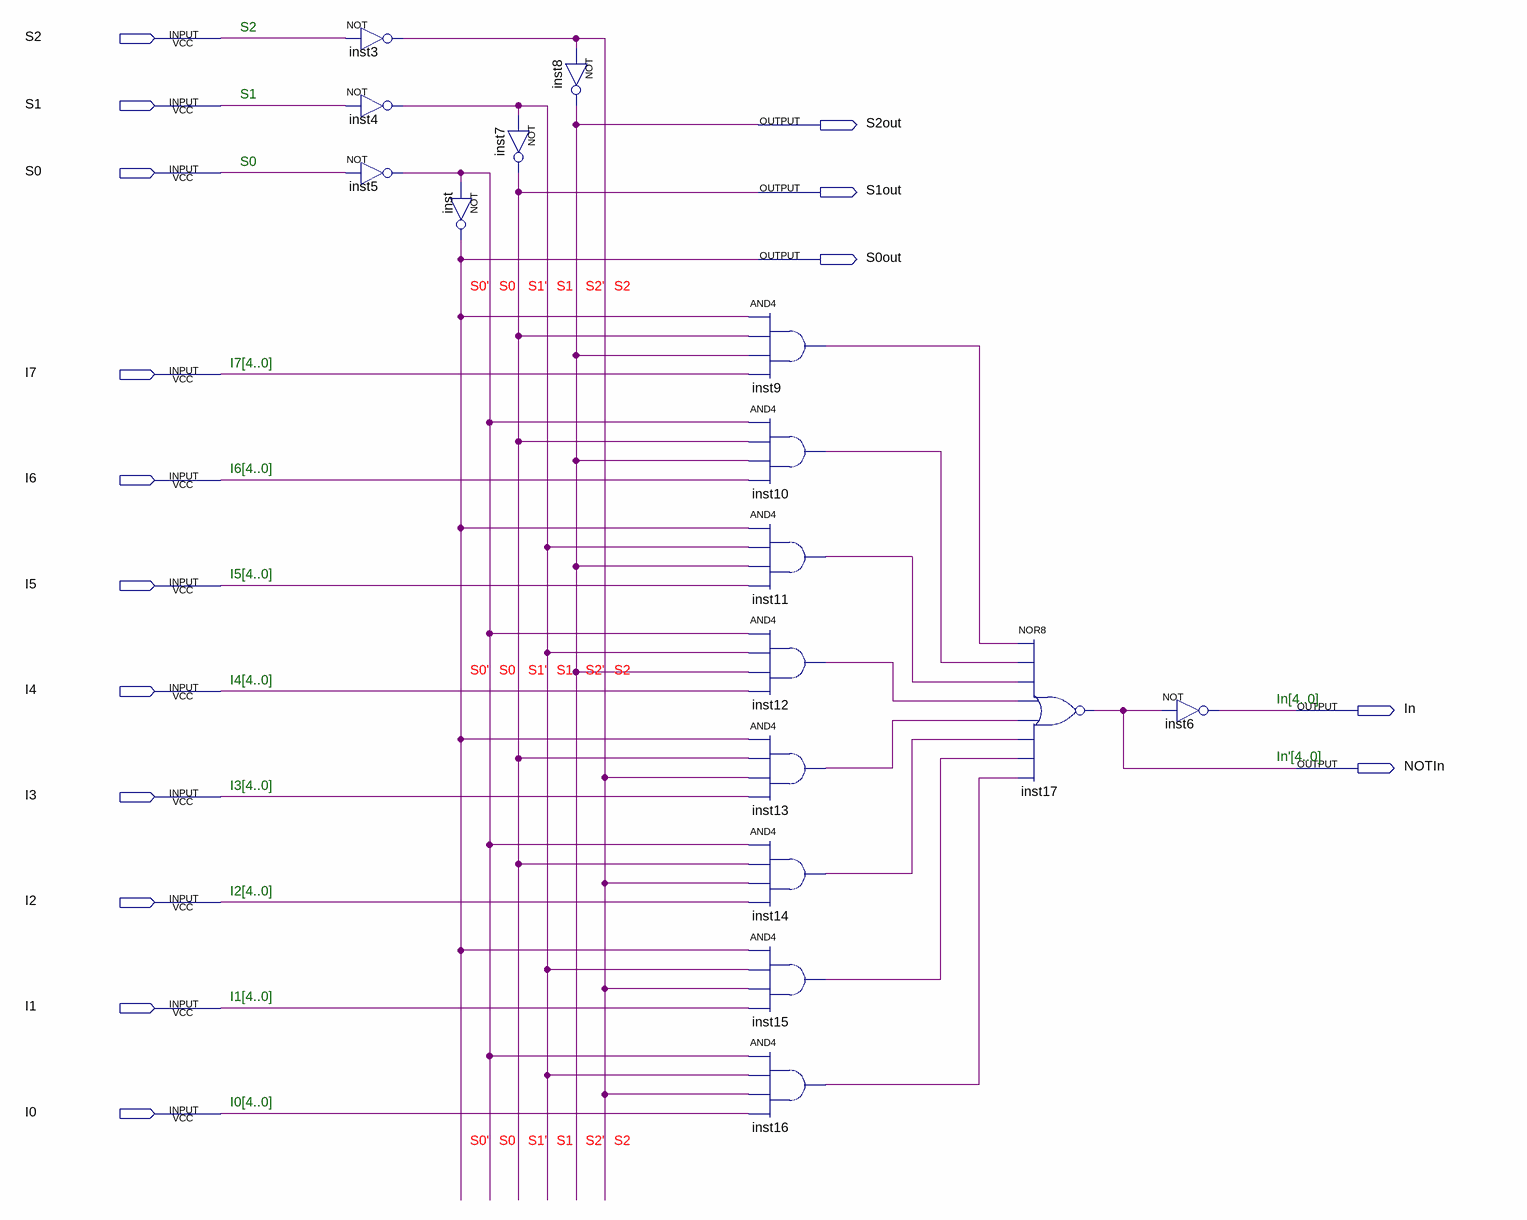
[diagram p0: schematic sheet]
// Quartus schematic mhrs_MUX_8x1.bdf as structural Verilog: 16 symbols, 16 pins
module mhrs_MUX_8x1 (
  input  S2,
  input  S1,
  input  S0,
  input  I7,
  input  I6,
  input  I5,
  input  I4,
  input  I3,
  input  I2,
  input  I1,
  input  I0,
  output S2out,
  output S1out,
  output S0out,
  output In,
  output NOTIn
);

  wire inst3_out, inst4_out, inst5_out, inst9_out, inst10_out, inst11_out, inst12_out, inst13_out,
       inst14_out, inst15_out, inst16_out;

  not inst3 (inst3_out, S2);
  not inst4 (inst4_out, S1);
  not inst5 (inst5_out, S0);
  not inst (S0out, inst5_out);
  not inst7 (S1out, inst4_out);
  not inst8 (S2out, inst3_out);
  and inst9 (inst9_out, S0out, S1out, S2out, I7);
  and inst10 (inst10_out, inst5_out, S1out, S2out, I6);
  and inst11 (inst11_out, S0out, inst4_out, S2out, I5);
  and inst12 (inst12_out, inst5_out, inst4_out, S2out, I4);
  and inst13 (inst13_out, S0out, S1out, inst3_out, I3);
  and inst14 (inst14_out, inst5_out, S1out, inst3_out, I2);
  and inst15 (inst15_out, S0out, inst4_out, inst3_out, I1);
  and inst16 (inst16_out, inst5_out, inst4_out, inst3_out, I0);
  nor inst17 (NOTIn, inst9_out, inst10_out, inst11_out, inst12_out, inst13_out, inst14_out, inst15_out, inst16_out);
  not inst6 (In, NOTIn);

  // Notes on the sheet:
  //   S2
  //   S1
  //   S0
  //   S0'
  //   S0
  //   S1'
  //   S1
  //   S2'
  //   S2
  //   I7[4..0]
  //   I6[4..0]
  //   I5[4..0]
  //   S0'
  //   S0
  //   S1'
  //   S1
  //   S2'
  //   S2
  //   I4[4..0]
  //   In[4..0]
  //   In'[4..0]
  //   I3[4..0]
  //   I2[4..0]
  //   I1[4..0]
  //   I0[4..0]
  //   S0'
  //   S0
  //   S1'
  //   S1
  //   S2'
  //   S2
endmodule
